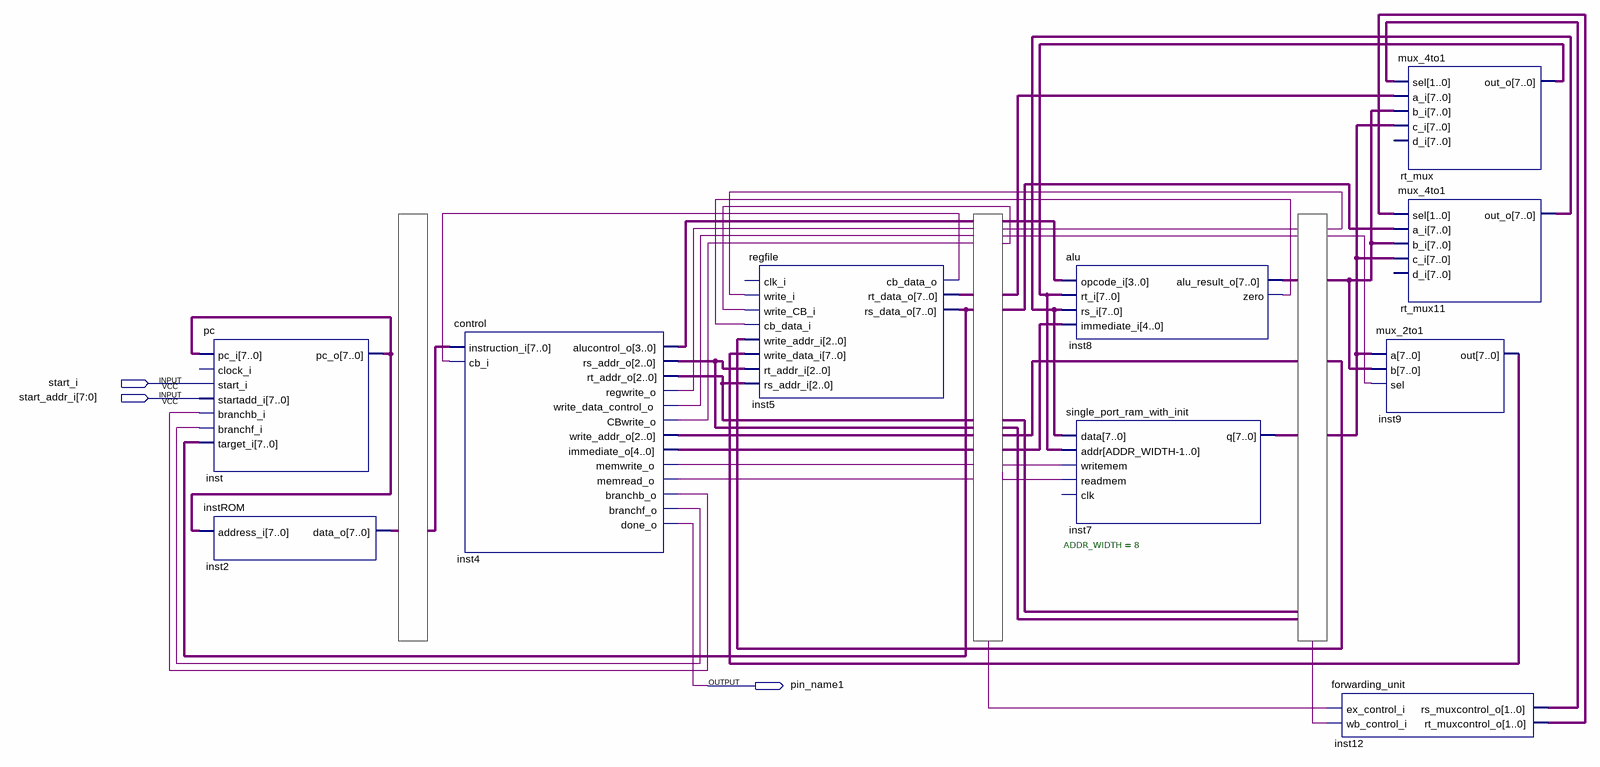
[diagram p0: schematic sheet]
// Quartus schematic pipelinedcpu.bdf as structural Verilog: 10 symbols, 3 pins
module pipelinedcpu (
  input  start_i,
  input  [7:0] start_addr_i,
  output pin_name1
);

  wire inst4_branchb_o, inst4_branchf_o, inst4_cbwrite_o, inst4_memread_o, inst4_memwrite_o,
       inst4_regwrite_o, inst4_write_data_control_o, inst5_cb_data_o, inst8_zero, undriven, undriven_6,
       undriven_7, undriven_8, undriven_9, undriven_14, undriven_15;
  wire [1:0] inst12_rs_muxcontrol_o, inst12_rt_muxcontrol_o;
  wire [2:0] inst4_rs_addr_o, inst4_rt_addr_o, inst4_write_addr_o, undriven_2;
  wire [3:0] inst4_alucontrol_o, undriven_4;
  wire [4:0] inst4_immediate_o, undriven_3;
  wire [7:0] inst2_data_o, inst5_rs_data_o, inst5_rt_data_o, inst7_q, inst8_alu_result_o, inst9_out,
       inst_pc_o, rt_mux11_out_o, rt_mux_out_o, undriven_5, undriven_10, undriven_11, undriven_12,
       undriven_13;

  pc inst (
    .pc_i(inst_pc_o), .start_i(start_i), .startadd_i(start_addr_i), .branchb_i(inst4_branchb_o),
    .branchf_i(inst4_branchf_o), .target_i(inst5_rs_data_o), .pc_o(inst_pc_o));  // open: clock_i
  instROM inst2 (.address_i(inst_pc_o), .data_o(inst2_data_o));
  control inst4 (
    .instruction_i(undriven_5), .cb_i(inst5_cb_data_o), .alucontrol_o(inst4_alucontrol_o),
    .rs_addr_o(inst4_rs_addr_o), .rt_addr_o(inst4_rt_addr_o), .regwrite_o(inst4_regwrite_o),
    .write_data_control_o(inst4_write_data_control_o), .CBwrite_o(inst4_cbwrite_o),
    .write_addr_o(inst4_write_addr_o), .immediate_o(inst4_immediate_o), .memwrite_o(inst4_memwrite_o),
    .memread_o(inst4_memread_o), .branchb_o(inst4_branchb_o), .branchf_o(inst4_branchf_o), .done_o(pin_name1));
  regfile inst5 (
    .write_i(undriven), .write_CB_i(undriven_6), .cb_data_i(inst8_zero), .write_addr_i(undriven_2),
    .write_data_i(inst9_out), .rt_addr_i(inst4_rs_addr_o), .rs_addr_i(inst4_rt_addr_o),
    .cb_data_o(inst5_cb_data_o), .rt_data_o(inst5_rt_data_o), .rs_data_o(inst5_rs_data_o));  // open: clk_i
  alu inst8 (
    .opcode_i(undriven_4), .rt_i(rt_mux_out_o), .rs_i(rt_mux11_out_o), .immediate_i(undriven_3),
    .alu_result_o(inst8_alu_result_o), .zero(inst8_zero));
  single_port_ram_with_init #(.ADDR_WIDTH(8)) inst7 (
    .data(rt_mux11_out_o), .addr(rt_mux_out_o), .writemem(undriven_7), .readmem(undriven_8), .q(inst7_q));  // open: clk
  forwarding_unit inst12 (
    .ex_control_i(undriven_14), .wb_control_i(undriven_15), .rs_muxcontrol_o(inst12_rs_muxcontrol_o),
    .rt_muxcontrol_o(inst12_rt_muxcontrol_o));
  mux_4to1 rt_mux (
    .sel(inst12_rs_muxcontrol_o), .a_i(undriven_10), .b_i(undriven_12), .c_i(undriven_13),
    .out_o(rt_mux_out_o));  // open: d_i
  mux_4to1 rt_mux11 (
    .sel(inst12_rt_muxcontrol_o), .a_i(undriven_11), .b_i(undriven_12), .c_i(undriven_13),
    .out_o(rt_mux11_out_o));  // open: d_i
  mux_2to1 inst9 (.a(undriven_13), .b(undriven_12), .sel(undriven_9), .out(inst9_out));
endmodule
